# Altium schematic sheet HV Sense.SchDoc
size A4
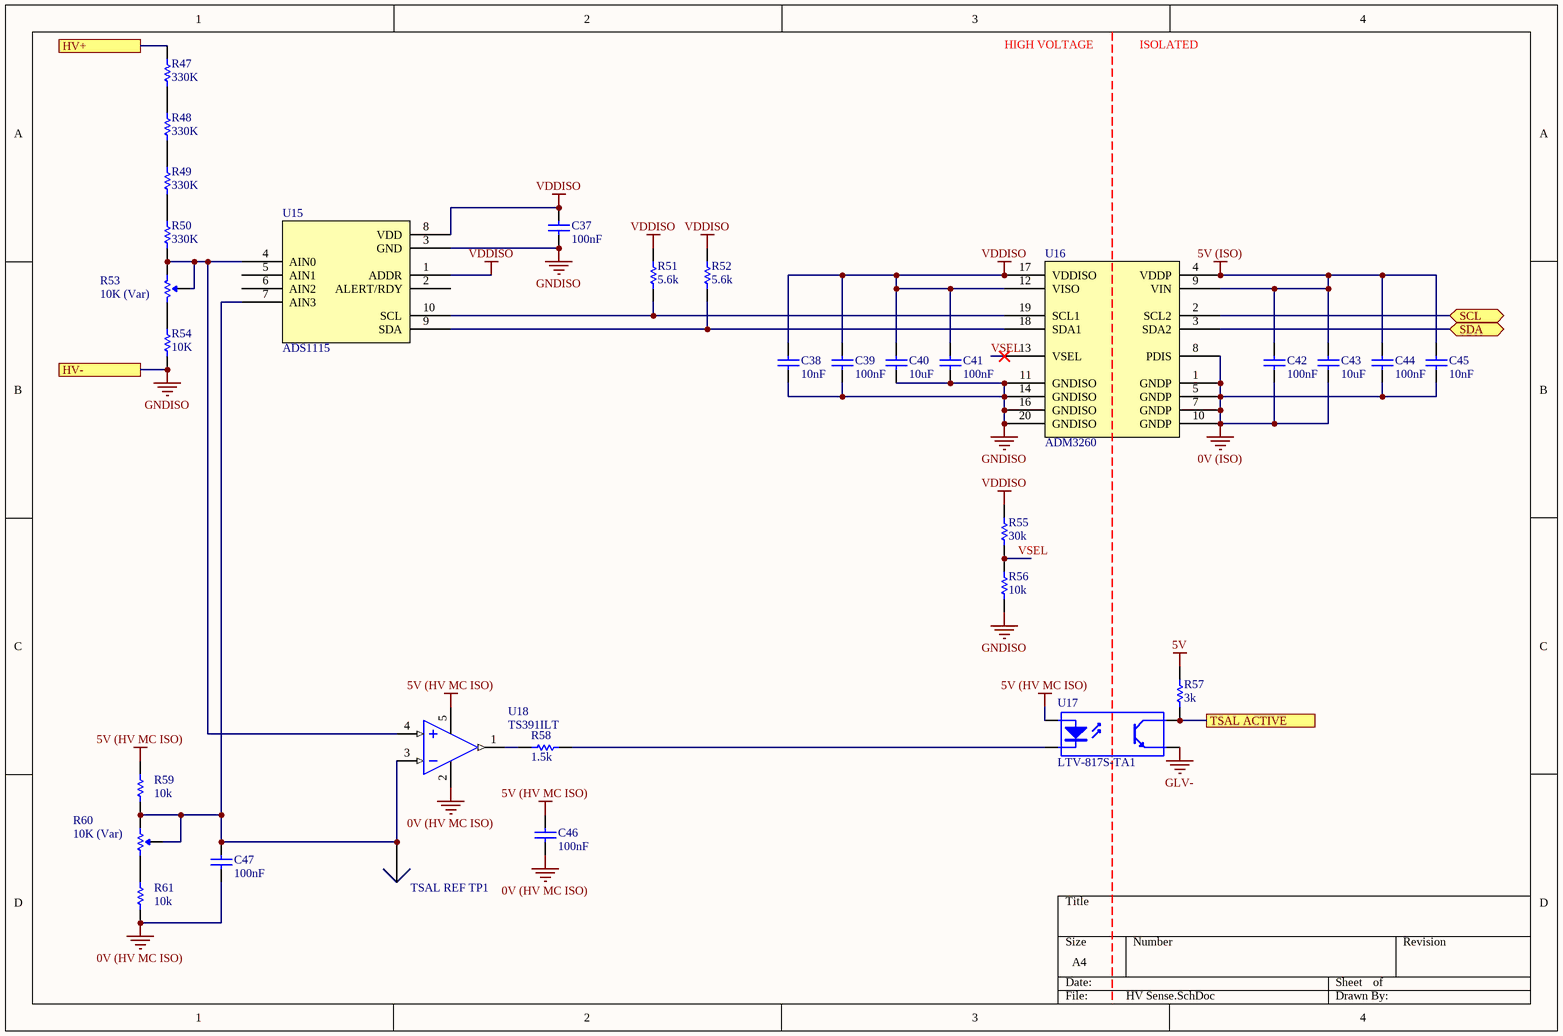
[diagram p0: HV Sense.SchDoc]

## Parts
C37  100nF  [0805]
C38  10nF  [0805]
C39  100nF  [0805]
C40  10uF  [0805]
C41  100nF  [0805]
C42  100nF  [0805]
C43  10uF  [0805]
C44  100nF  [0805]
C45  10nF  [0805]
C46  100nF  [0805]
C47  100nF  [0805]
R47  330K  [VB 0204]
R48  330K  [VB 0204]
R49  330K  [VB 0204]
R50  330K  [VB 0204]
R51  5.6k  [0805]
R52  5.6k  [0805]
R53  10K (Var)  [B 3296]
R54  10K  [VB 0204]
R55  30k  [0805]
R56  10k  [0805]
R57  3k  [0805]
R58  1.5k  [0805]
R59  10k  [0805]
R60  10K (Var)  [B 3296]
R61  10k  [0805]
TSAL_REF_TP1  0mm  [TH Test Point]  (value not drawn)
U15  ADS1115  [TI 10-VSSOP]
U16  ADM3260  [AD 20-SSOP]
U17  LTV-817S-TA1  [ON 4-SMD]
U18  TS391ILT  [ON SOT-23-5]

## Ports
HV+, HV-, SCL (bidir), SDA (bidir), TSAL ACTIVE

## Nets
0V (HV MC ISO): C46.1 C47.1 R61.1 U18.2(VCC-)
0V (ISO): C42.1 C43.1 C44.1 C45.1 U16.1(GNDP) U16.5(GNDP) U16.7(GNDP) U16.8(PDIS) U16.10(GNDP)
5V: R57.2
5V (HV MC ISO): C46.2 R59.2 U17.1(A) U18.5(VCC+)
5V (ISO): C42.2 C43.2 C44.2 C45.2 U16.4(VDDP) U16.9(VIN)
GLV-: U17.3(E)
GNDISO: C37.2 C38.1 C39.1 C40.1 C41.2 R54.1 R56.1 U15.3(GND) U16.11(GNDISO) U16.14(GNDISO) U16.16(GNDISO) U16.20(GNDISO) ; port HV-
VDDISO: C37.1 C38.2 C39.2 C40.2 C41.1 R51.2 R52.2 R55.2 U15.1(ADDR) U15.8(VDD) U16.12(VISO) U16.17(VDDISO)
HV+: R47.2 ; port HV+
SCL: U16.2(SCL2) ; port SCL
SDA: U16.3(SDA2) ; port SDA
TSAL ACTIVE: R57.1 U17.4(C) ; port TSAL ACTIVE
VSEL: R55.1 R56.2 U16.13(VSEL)
NetC47_2: C47.2 R59.1 R60.1(CCW) R60.2(Wiper) TSAL_REF_TP1.1 U15.7(AIN3) U18.3(IN-)
NetR47_1: R47.1 R48.2
NetR48_1: R48.1 R49.2
NetR49_1: R49.1 R50.2
NetR50_1: R50.1 R53.2(Wiper) R53.3(CW) U15.4(AIN0) U18.4(IIN+)
NetR51_1: R51.1 U15.10(SCL) U16.19(SCL1)
NetR52_1: R52.1 U15.9(SDA) U16.18(SDA1)
NetR53_1: R53.1(CCW) R54.2
NetR58_1: R58.1 U18.1(OUT)
NetR58_2: R58.2 U17.2(K)
NetR60_3: R60.3(CW) R61.2

Not connected (* = marked no-connect by the designer): U15 2(ALERT/RDY) 5(AIN1) 6(AIN2)

## Notes on the sheet
- HIGH VOLTAGE
- ISOLATED

## Library data of the parts
C37 C39 C41 C42 C44 C46 C47 = GCM21BR71E104KA37L: Manufacturer: muRata; Tolerance: 10%; Material: X7R; Rated Voltage: 25V; Part Number: GCM21BR71E104KA37L; Value: 100nF
C38 C45 = GCM21BR71H103KA37L: Manufacturer: muRata; Tolerance: 10%; Material: X7R; Rated Voltage: 50V; Part Number: GCM21BR71H103KA37L; Value: 10nF
C40 C43 = GRM21BR6YA106KE43L: Manufacturer: muRata; Tolerance: 10%; Material: X5R; Rated Voltage: 50V; Part Number: GRM21BR6YA106KE43L; Value: 10uF; Digikey Part Number: 490-10514-6-ND
R47-R50 = MMA02040C3303FB300: Manufacturer: Vishay Beyschlag; Tolerance: 0.01; Rated Voltage: 0.4W; Part Number: MMA02040C3303FB300; Value: 330K; Digikey Part Number: MMA-330KACT-ND
R51 R52 = RC0805FR075K6L: Manufacturer: YAGEO; Tolerance: 0.01; Rated Voltage: 0.125W; Part Number: RC0805FR075K6L; Value: 5.6k; Material: FR-07
R53 R60 = 3296W-1-103LF: Manufacturer: Bournes Inc; Tolerance: 0.1; Rated Voltage: 0.5W; Part Number: 3296W-1-103LF; Value: 10K (Var); Digikey Part Number: 3296W-103LF-ND
R54 = MMA02040C1002FB300: Manufacturer: Vishay Beyschlag; Tolerance: 0.01; Rated Voltage: 0.4W; Part Number: MMA02040C1002FB300; Value: 10K; Digikey Part Number: MMA-10KACT-ND
R55 = RC0805FR0730KL: Manufacturer: YAGEO; Tolerance: 0.01; Rated Voltage: 0.125W; Part Number: RC0805FR0730KL; Value: 30k; Material: FR-07
R56 R59 R61 = RC0805FR0710KL: Manufacturer: YAGEO; Tolerance: 0.01; Rated Voltage: 0.125W; Part Number: RC0805FR0710KL; Value: 10k; Material: FR-07
R57 = RC0805FR073KL: Manufacturer: YAGEO; Tolerance: 0.01; Rated Voltage: 0.125W; Part Number: RC0805FR073KL; Value: 3k; Material: FR-07
R58 = RC0805FR071K5L: Manufacturer: YAGEO; Tolerance: 0.01; Rated Voltage: 0.125W; Part Number: RC0805FR071K5L; Value: 1.5k; Material: FR-07
TSAL_REF_TP1 = TH Test Point: Positions: 1; Angle: 0; Flange: No; Contact: NA; Part Number: TH Test Point; Pitch: 0mm; Row Spacing: 0mm
U15 = ADS1115: 16 Bit Analog to Digital Converter 2, 4 Input 1 Sigma-Delta 10-VSSOP; Manufacturer: Texas Instruments; Part Number: ADS1115; Digikey Part Number: 296-38849-1-ND; Digikey Link: https://www.digikey.com/product-detail/en/texas-instruments/ADS1115IDGSR/296-38849-1-ND/5142969
U16 = ADM3260: I²C Digital Isolator 2500Vrms 2 Channel 25kV/µs CMTI 20-SSOP (0.209", 5.30mm Width); Manufacturer: Analog Devices; Part Number: ADM3260; Digikey Part Number: ADM3260ARSZ-RL7CT-ND; Digikey Link: https://www.digikey.com/product-detail/en/analog-devices-inc/ADM3260ARSZ-RL7/ADM3260ARSZ-RL7CT-ND/5233040
U17 = LTV-817S-TA1: 35V 50ma Optocoupler (VF=1.2V); Manufacturer: Lite-On Inc; Part Number: LTV-817S-TA1; Digikey Part Number: 160-1893-2-ND; Digikey Link: https://www.digikey.com/product-detail/en/lite-on-inc/LTV-817S-TA1/160-1893-2-ND/388451
U18 = TS391ILT: IC COMP LO PWR SGL V SOT 23-5L; Manufacturer: STMicroelectronics; Part Number: TS391ILT; Digikey Part Number: 497-2275-2-ND; Digikey Link: https://www.digikey.com/product-detail/en/stmicroelectronics/TS391ILT/497-2275-2-ND/599407